# EAGLE design voltageRegulator (EAGLE 7.2.0)
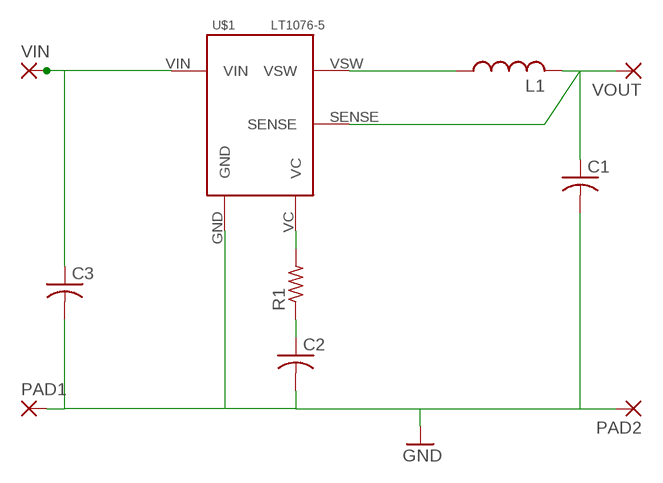
[diagram p0: schematic, sheet 1]

## Parts
C1  C-US025-060X050  [C025-060X050]
C2  C-US025-030X050  [C025-030X050]
C3  C-US025-060X050  [C025-060X050]
L1  L-US6000-XXX-RC  [6000-XXXX-RC]
PAD1  3,81/1,4  [3,81/1,4]
PAD2  3,81/1,4  [3,81/1,4]
R1  R-US_0204/7  [0204/7]
U$1  LT1076-5  [TO220-5]
VIN  3,81/1,4  [3,81/1,4]
VOUT  3,81/1,4  [3,81/1,4]

## Nets
GND: C1.2 C2.2 C3.2 PAD1.1(P) PAD2.1(P) U$1.GND
N$1: R1.2 U$1.VC
N$2: C2.1 R1.1
N$3: C3.1 U$1.VIN VIN.1(P)
N$7: L1.1 U$1.VSW
N$8: C1.1 L1.2 U$1.SENSE VOUT.1(P)

## Library data of the parts
C1-C3 = rcl:C-US: CAPACITOR, American symbol
L1 = rcl:L-US: INDUCTOR, American symbol
PAD1 PAD2 VIN VOUT = wirepad:3,81/1,4: THROUGH-HOLE PAD
R1 = rcl:R-US_: RESISTOR, American symbol
U$1 = SeniorDesign:LT1076-5

## Net classes
0 default: width 0.305 mm, drill 0.508 mm, clearance 0.254 mm

## Board
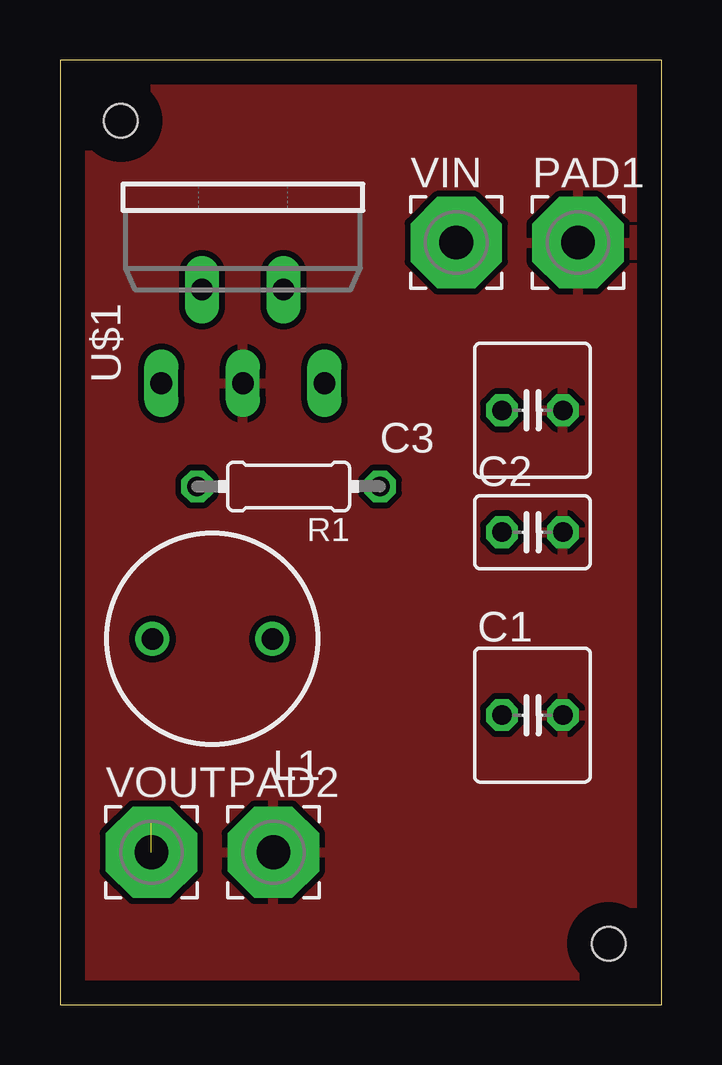
[diagram p1: board, top side]
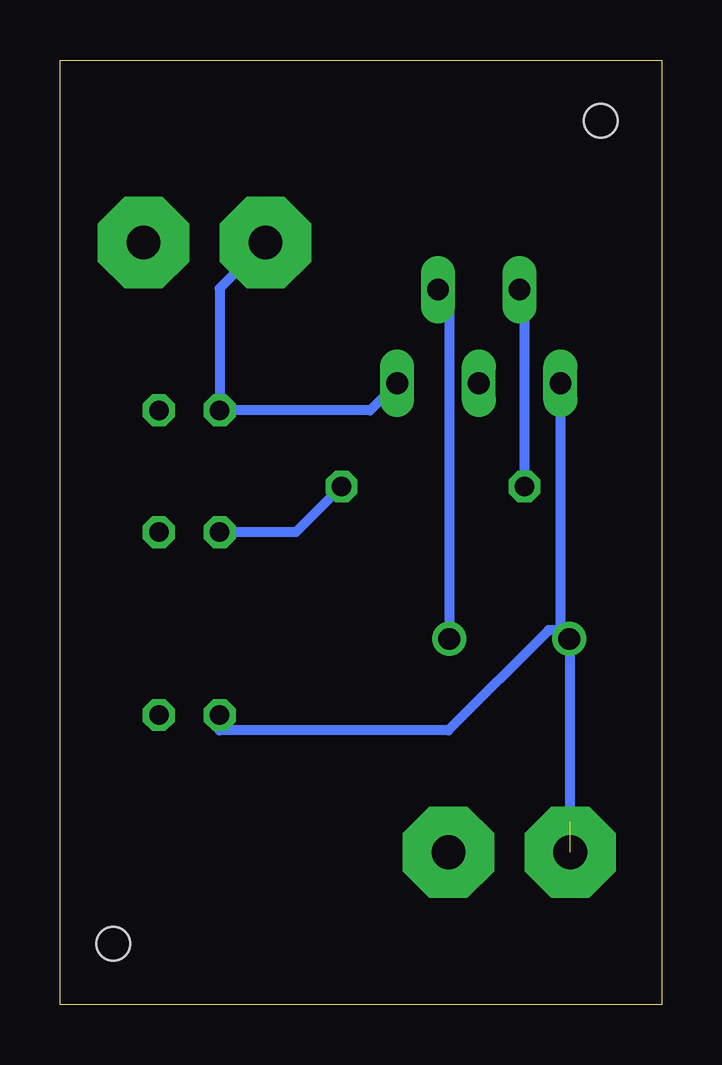
[diagram p2: board, bottom side, seen from below]

Size 25.07 x 39.36 mm. Coordinates in mm from the lower left corner, seen from the top.
Outline: 0,0 25.07,0 25.07,39.36 0,39.36 0,0
Copper layers (1*16): Top 0.035mm / dielectric 1.5mm / Bottom 0.035mm
Design rules "default": minimum track width 10mil, minimum drill 24mil, track to track 8mil, track to pad 8mil, pad to pad 8mil, via to via 8mil, smd to smd 8mil, copper to edge 40mil, drill to drill 8mil, minimum pad ring 10mil, minimum via ring 8mil, stop-mask expansion 4mil, vias tented up to drill 0mil, thermal gap 10mil
Holes 1.4 mm at 2.54,36.83 22.86,2.54

### Footprints (pad centres in the part's own frame; a part is rotated, then mirrored left to right if it is on the bottom)
C025-060X050 = drill 0.813 octagon: 1 -1.27,0; 2 1.27,0
C025-030X050 = drill 0.813 octagon: 1 -1.27,0; 2 1.27,0
6000-XXXX-RC = drill 0.9 pad 1.422: 1 -2.5,0; 2 2.5,0
3,81/1,4 = drill 1.397 pad 3.81 octagon: 1 0,0
0204/7 = drill 0.813 octagon: 1 -3.81,0; 2 3.81,0
TO220-5 = drill 0.9 long: GND 0,-8.4; SENSE -3.4,-8.4; VC -1.7,-4.5; VIN 3.4,-8.4; VSW 1.7,-4.5

### Placement (x,y rotation side)
C1  19.68,12.06 0 top
C2  19.68,19.68 0 top
C3  19.68,24.77 0 top
L1  6.35,15.24 180 top
PAD1  21.59,31.75 0 top
PAD2  8.89,6.35 0 top
R1  9.53,21.59 180 top
U$1  7.62,34.29 0 top
VIN  16.51,31.75 0 top
VOUT  3.81,6.35 0 top

### Tracks (layer width: path | path; a pad name or v marks a point on that pad's centre or on a via)
GND
  pour Top: -1.27,40.64 26.67,40.64 26.67,-1.27 -2.54,-1.27 -2.54,40.64
N$1
  Bottom 0.406: R1.2 5.71,29.59 U$1.VC
N$2
  Bottom 0.406: R1.1 15.24,19.68 C2.1
N$3
  Bottom 0.406: U$1.VIN 12.14,24.77 C3.1 18.41,29.84 VIN.1
N$7
  Bottom 0.406: U$1.VSW 8.85,29.32 L1.1
N$8  (1 unrouted)
  Bottom 0.406: U$1.SENSE 4.22,15.61 | 4.22,15.61 L1.2 3.81,15.2 3.81,7.62 3.85,7.66 | 4.22,15.61 4.71,15.61 8.89,11.43 18.41,11.43 C1.1